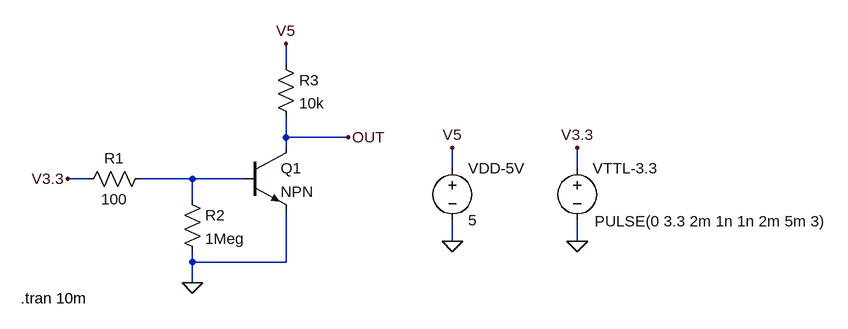
[diagram p0: schematic __3V3_to_5V_Converter.asc]
__3V3_to_5V_Converter.asc, the LTspice schematic file:
Version 4
SHEET 1 1304 680
WIRE 336 -16 336 -48
WIRE 336 96 336 64
WIRE 432 96 336 96
WIRE 336 112 336 96
WIRE 592 144 592 112
WIRE 784 144 784 112
WIRE 32 160 0 160
WIRE 192 160 112 160
WIRE 272 160 192 160
WIRE 192 192 192 160
WIRE 592 256 592 224
WIRE 784 256 784 224
WIRE 192 288 192 272
WIRE 336 288 336 208
WIRE 336 288 192 288
WIRE 192 320 192 288
FLAG 192 320 0
FLAG 0 160 V3.3
FLAG 784 112 V3.3
FLAG 592 112 V5
FLAG 336 -48 V5
FLAG 432 96 OUT
FLAG 784 256 0
FLAG 592 256 0
SYMBOL res 128 144 R90
WINDOW 0 0 56 VBottom 2
WINDOW 3 32 56 VTop 2
SYMATTR InstName R1
SYMATTR Value 100
SYMBOL res 176 176 R0
SYMATTR InstName R2
SYMATTR Value 1Meg
SYMBOL res 320 -32 R0
SYMATTR InstName R3
SYMATTR Value 10k
SYMBOL npn 272 112 R0
SYMATTR InstName Q1
SYMBOL voltage 784 128 R0
WINDOW 3 27 97 Left 2
WINDOW 123 0 0 Left 0
WINDOW 39 0 0 Left 0
SYMATTR Value PULSE(0 3.3 2m 1n 1n 2m 5m 3)
SYMATTR InstName VTTL-3.3
SYMBOL voltage 592 128 R0
WINDOW 123 0 0 Left 0
WINDOW 39 0 0 Left 0
SYMATTR InstName VDD-5V
SYMATTR Value 5
TEXT -72 344 Left 2 !.tran 10m

The netlist it stands for:
* __3V3_to_5V_Converter.asc
R1 N001 V3.3 100
R2 N001 0 1Meg
R3 V5 OUT 10k
Q1 OUT N001 0 0 NPN
VTTL-3.3 V3.3 0 PULSE(0 3.3 2m 1n 1n 2m 5m 3)
VDD-5V V5 0 5
.model NPN NPN
.model PNP PNP
.lib standard.bjt
.tran 10m
.backanno
.end